# Altium schematic sheet STM32_microcontroller_IOs.SchDoc: STM32 microcontroller I/Os
size A4; Date: Not used; ApprovedBy: Not used; CheckedBy: Not used; Author: Not used; CompanyName: STMicroelectronics; DrawnBy: Not used; Engineer: Not used; Organization: Not used; Address1: Not used; Address2: Not used; Address3: Not used; Address4: Not used; DocumentNumber: 3; Revision: Not used; SheetNumber: 3; SheetTotal: 8; CurrentTime: Not used; CurrentDate: Not used; Time: Not used; DocumentFullPathAndName: Not used; DocumentName: Not used; ModifiedDate: Not used; ImagePath: Not used; ProjectName: Not used; Application_BuildNumber: Not used
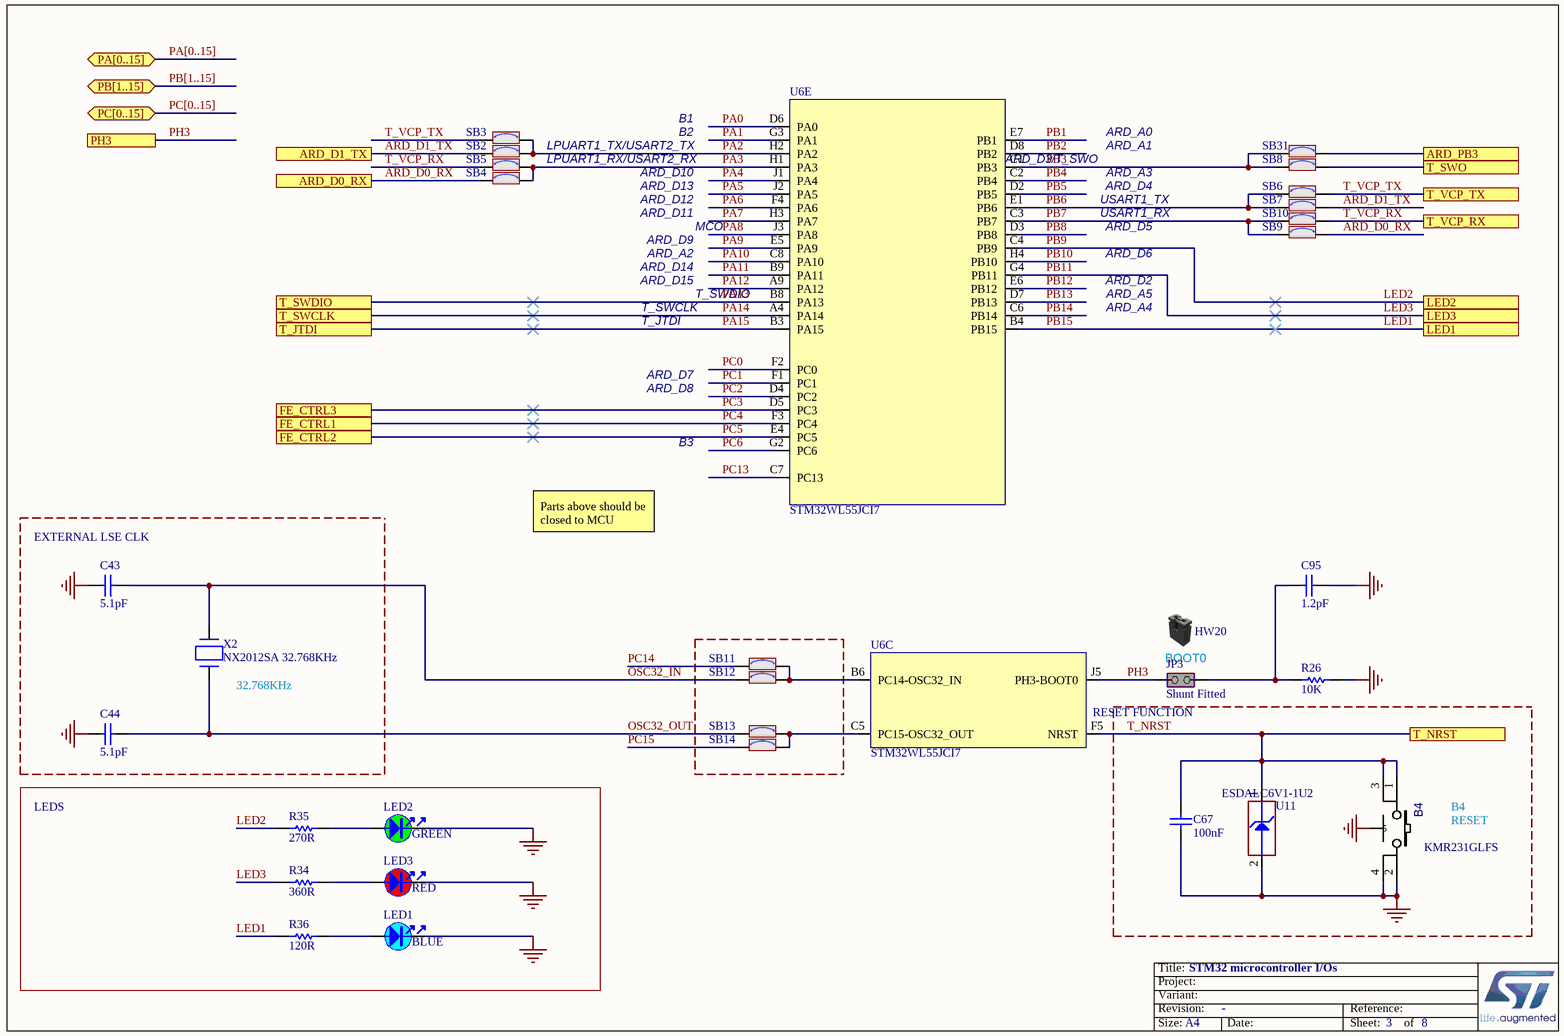
[diagram p0: STM32_microcontroller_IOs.SchDoc]

## Parts
B4  value KMR231GLFS  [SWI_C&K_Y78B23110FP__ITT_KMR231GLFS]
C43  value 5.1pF  [C0402]
C44  value 5.1pF  [C0402]
C67  value 100nF  [C0402]
C95  value 1.2pF  [C0402]  (hidden comment: Capacitor)
HW20  (no value)  (mechanical)
JP3  value Shunt Fitted  [CON_SAMTEC_TSW-102-07-G-S]
LED1  value BLUE  [LED_0603_OSRAM_LB-Q39G-L2OO-35-1_BLUE_1A2K_H0P4]
LED2  value GREEN  [LED_0603_OSRAM_LG-Q396-PS-35_GREEN_1A2K_H0P4]
LED3  value RED  [LED_0603_VISHAY_VLMS1300-GS08_RED_1A2K_H0P8]
R26  value 10K  [R0603]
R34  value 360R  [R0402]
R35  value 270R  [R0402]
R36  value 120R  [R0402]
SB2  (no value)  [SOLDER-BRIDGE_R0603-0R]
SB3  (no value)  [SOLDER-BRIDGE_R0603-0R]
SB4  (no value)  [SOLDER-BRIDGE_R0603-0R]
SB5  (no value)  [SOLDER-BRIDGE_R0603-0R]
SB6  (no value)  [SOLDER-BRIDGE_R0603-0R]
SB7  (no value)  [SOLDER-BRIDGE_R0603-0R]
SB8  (no value)  [SOLDER-BRIDGE_R0603-0R]
SB9  (no value)  [SOLDER-BRIDGE_R0603-0R]
SB10  (no value)  [SOLDER-BRIDGE_R0603-0R]
SB11  (no value)  [SOLDER-BRIDGE_R0603-0R]
SB12  (no value)  [SOLDER-BRIDGE_R0603-0R]
SB13  (no value)  [SOLDER-BRIDGE_R0603-0R]
SB14  (no value)  [SOLDER-BRIDGE_R0603-0R]
SB31  (no value)  [SOLDER-BRIDGE_R0603-0R]
U6  value STM32WL55JCI7  [ICC_UFBGA73_5X5_P050]  (parts C,E of 5)
U11  value ESDALC6V1-1U2  [ESD_ST0201]
X2  value NX2012SA 32.768KHz  [CRY_NX2012SA_2P]

## Blocks framed on the sheet
LEDS: LED1-LED3 R34-R36

## Ports
ARD_D0_RX, ARD_D1_TX, ARD_PB3, FE_CTRL1, FE_CTRL2, FE_CTRL3, LED1, LED2, LED3, PA[0..15] (bidir), PB[1..15] (bidir), PC[0..15] (bidir), PH3, T_JTDI, T_NRST, T_SWCLK, T_SWDIO, T_SWO, T_VCP_RX, T_VCP_TX

## Nets
GND: B4.2 B4.4 B4.5 C43.2 C44.2 C67.1 C95.1 LED1.2 LED2.2 LED3.2 R26.1 U11.2(GND)
ARD_D0_RX: SB4.2 SB9.1 ; port ARD_D0_RX
ARD_D1_TX: SB2.2 SB7.1 ; port ARD_D1_TX
ARD_PB3: SB31.2 ; port ARD_PB3
LED1: R36.1 U6.B4(PB15) ; port LED1  [also labelled PB15]
LED2: R35.1 U6.C4(PB9) ; port LED2  [also labelled PB9]
LED3: R34.1 U6.G4(PB11) ; port LED3  [also labelled PB11]
OSC32_IN: C43.1 SB12.1 X2.2(X2)
OSC32_OUT: C44.1 SB13.1 X2.1(X1)
PA0: U6.D6(PA0)
PA1: U6.G3(PA1)
PA2: SB2.1 SB3.2 U6.H2(PA2)
PA3: SB4.1 SB5.2 U6.H1(PA3)
PA4: U6.J1(PA4)
PA5: U6.J2(PA5)
PA6: U6.F4(PA6)
PA7: U6.H3(PA7)
PA8: U6.J3(PA8)
PA9: U6.E5(PA9)
PA10: U6.C8(PA10)
PA11: U6.B9(PA11)
PA12: U6.A9(PA12)
PA13: U6.B8(PA13) ; port T_SWDIO
PA14: U6.A4(PA14) ; port T_SWCLK
PA15: U6.B3(PA15) ; port T_JTDI
PB1: U6.E7(PB1)
PB2: U6.D8(PB2)
PB3: SB8.1 SB31.1 U6.C1(PB3)
PB4: U6.C2(PB4)
PB5: U6.D2(PB5)
PB6: SB6.1 SB7.2 U6.E1(PB6)
PB7: SB9.2 SB10.1 U6.C3(PB7)
PB8: U6.D3(PB8)
PB10: U6.H4(PB10)
PB12: U6.E6(PB12)
PB13: U6.D7(PB13)
PB14: U6.C6(PB14)
PC0: U6.F2(PC0)
PC1: U6.F1(PC1)
PC2: U6.D4(PC2)
PC3: U6.D5(PC3) ; port FE_CTRL3
PC4: U6.F3(PC4) ; port FE_CTRL1
PC5: U6.E4(PC5) ; port FE_CTRL2
PC6: U6.G2(PC6)
PC13: U6.C7(PC13)
PC14: SB11.1
PC15: SB14.1
PH3: JP3.1(COMMON) U6.J5(PH3-BOOT0) ; port PH3
T_NRST: B4.1 B4.3 C67.2 U6.F5(NRST) U11.1(IO1) ; port T_NRST
T_SWO: SB8.2 ; port T_SWO
T_VCP_RX: SB5.1 SB10.2 ; port T_VCP_RX
T_VCP_TX: SB3.1 SB6.2 ; port T_VCP_TX
NetC95_2: C95.2 JP3.2(NO) R26.2
NetLED1_1: LED1.1 R36.2
NetLED2_1: LED2.1 R35.2
NetLED3_1: LED3.1 R34.2
NetSB11_2: SB11.2 SB12.2 U6.B6(PC14-OSC32_IN)
NetSB13_2: SB13.2 SB14.2 U6.C5(PC15-OSC32_OUT)

## Buses and harness runs
bus PA[0..15] = port PA[0..15]
bus PB[1..15] = port PB[1..15]
bus PC[0..15] = port PC[0..15]

## Notes on the sheet
- LPUART1_TX/USART2_TX
- LPUART1_RX/USART2_RX
- ARD_D10
- B2
- B1
- ARD_D3/T_SWO
- ARD_A0
- ARD_A1
- ARD_A3
- ARD_D13
- ARD_D12
- ARD_D11
- ARD_D9
- MCO
- USART1_RX
- USART1_TX
- ARD_D5
- ARD_D4
- T_SWCLK
- T_SWDIO
- ARD_D14
- ARD_D15
- ARD_A2
- ARD_D6
- ARD_A4
- ARD_A5
- ARD_D2
- T_JTDI
- ARD_D7
- ARD_D8
- B3
- (near C43) EXTERNAL LSE CLK
- Parts above should be closed to MCU
- (near X2) 32.768KHz
- RESET FUNCTION
- (near JP3) BOOT0
- RESET
- B4
- Title:
- Project:
- Size:
- Revision:
- Variant:
- A4
- -
- Date:
- Reference:
- Sheet:
- of

## Library data of the parts
B4 = MCD-01485: Microminiature Tact Switch for SMT - KMR 2 Series - 1.9 mm height; Part_Type: Misc; Manufacturer: C&K; Provided_By: SUBCO; Internal_Part_Number: MCD-01485; Status: Checked; Manufacturer_Part_Number: KMR231GLFS; ComponentLink1Description: Datasheet; ComponentLink1URL: http://tunmcdsvn.tun.st.com/Component_Datasheet_Library/Trunk/Misc/C&K_tactile_switch_KMR_series; ECCN_US: n/a; ECCN_EU: n/a
C43 C44 = MCD-00003: Capacitor, MLCC, 5.1pF, 50V, NPO, +-0.25pF, 0402, T=0.5mm; Manufacturer_Part_Number: CC0402CRNPO9BN5R1; Manufacturer: YAGEO; Provided_By: SUBCO; ECCN_US: EAR99; ECCN_EU: NEC; Internal_Part_Number: MCD-00003; Status: Released; Part_Type: Capacitor; Package: C0402; ComponentLink1Description: Datasheet; ComponentLink1URL: http://tunmcdsvn.tun.st.com/Component_Datasheet_Library/Trunk/Capacitors/Yageo_Capacitor_NP0_16V-to-50V
C67 = MCD-00102: Capacitor, MLCC, 100nF, 16V, X7R, 10%, 0402, T=0,5mm; Manufacturer_Part_Number: CC0402KRX7R7BB104; Manufacturer: YAGEO; Alternate_Manufacturer_Part_Number: GCM155R71C104KA55D; Alternate_Manufacturer: MURATA; Provided_By: SUBCO; ECCN_US: EAR99; ECCN_EU: NEC; Internal_Part_Number: MCD-00102; Status: Released; Package: C0402; ComponentLink1Description: Datasheet; Part_Type: Capacitor; ComponentLink1URL: http://tunmcdsvn.tun.st.com/Component_Datasheet_Library/Trunk/Capacitors/Yageo_Multilayer_Capacitor_X7R_series_100pF_to_22uF
C95 = MCD-02065: Capacitor, High Q type for high frequency and high power, SMD, 1.2pF, 50V, 0,05pf, 0402; Part_Preference: Recommended; Manufacturer: MURATA; Manufacturer_Part_Number: GJM1555C1H1R2WB01D; Order_Code_RS: 846-7246; Internal_Part_Number: MCD-02065; BMS_Part_Number: N/A; Status: Checked; Part_Type: Capacitor; Alternate_Manufacturer: N/A; Alternate_Manufacturer_Part_Number: N/A; Package: C0402; ComponentLink1Description: Datasheet; ComponentLink1URL: http://tunmcdsvn.tun.st.com/Component_Datasheet_Library/Trunk/Capacitors/MURATA_Chip_Monolithic_Ceramic_Capacitors; Order_Code_Digikey: 490-11195-2-ND; Order_Code_Farnell: 2781428
HW20 = MCD-00043: SHUNT 2.54mm BLACK; Manufacturer_Part_Number: SNT-100-BK-G; Manufacturer: SAMTEC; Part_Type: Mechanical; Alternate_Manufacturer_Part_Number: 316102S111A; Alternate_Manufacturer: JIUBABA; Provided_By: SUBCO; Value: SNT-100-BK-G; Internal_Part_Number: MCD-00043; ComponentLink1Description: Datasheet; Status: Released; ComponentLink1URL: http://tunmcdsvn.tun.st.com/Component_Datasheet_Library/Trunk/Connectors/Samtec_Shunt_Jumper_SNT100; ECCN_US: n/a; ECCN_EU: n/a
JP3 = MCD-00683: Header, 2x1, 2,54mm, VR, TH, Height 5.84mm/2.54mm - Shunt Fitted by default; Part_Type: Connector; Manufacturer_Part_Number: TSW-102-07-x-S; Manufacturer: SAMTEC; Alternate_Manufacturer_Part_Number: 313102S111116; Alternate_Manufacturer: LIANYI; Provided_By: SUBCO; Internal_Part_Number: MCD-00683; Status: Released; ComponentLink1Description: Datasheet; ComponentLink1URL: http://tunmcdsvn.tun.st.com/Component_Datasheet_Library/Trunk/Connectors/Samtec_TSW-HTSW-series; ECCN_US: n/a; ECCN_EU: n/a
LED1 = MCD-00585: LED Blue, 0603 SMD, Forward Voltage Min=2,8V, Max=3,8V; Part_Type: Display; Manufacturer_Part_Number: LB Q39G-L2OO-35-1; Manufacturer: OSRAM OPTO SEMICONDUCTORS; Alternate_Manufacturer_Part_Number: 19-217-BHC-ZL1M2RY-3T-V4; Alternate_Manufacturer: EVERLIGHT; Order_Code_RS: 9148643; Provided_By: SUBCO; Internal_Part_Number: MCD-00585; Status: Released; Package: LED 0603; ComponentLink1Description: Datasheet; ComponentLink1URL: http://tunmcdsvn.tun.st.com/Component_Datasheet_Library/Trunk/Display/OSRAM_LED_BLUE_LB Q39G-L2OO-35-1; Order_Code_Digikey: 475-2816-1-ND; ECCN_US: n/a; ECCN_EU: n/a
LED2 = MCD-00588: LED Green, 0603 SMD, Forward Voltage Typ=2V, Max=2.5V; Part_Type: Display; Manufacturer_Part_Number: LG Q396-PS-35; Manufacturer: OSRAM OPTO SEMICONDUCTORS; Alternate_Manufacturer_Part_Number: VLMTG1300-GS08; Alternate_Manufacturer: VISHAY SEMICONDUCTOR OPTO DIVISION; Provided_By: SUBCO; Internal_Part_Number: MCD-00588; Status: Released; Package: LED 0603; ComponentLink1Description: Datasheet; ComponentLink1URL: http://tunmcdsvn.tun.st.com/Component_Datasheet_Library/Trunk/Display/OSRAM_LED_GREEN_LG Q396-PS-35; Order_Code_Digikey: LG Q396-PS-35-ND; ECCN_US: n/a; ECCN_EU: n/a
LED3 = MCD-00587: LED Red, 0603 SMD, 2V Forward Voltage; Part_Type: Display; Manufacturer_Part_Number: VLMS1300-GS08; Manufacturer: VISHAY; Alternate_Manufacturer_Part_Number: LS Q976-NR-1; Alternate_Manufacturer: OSRAM OPTO SEMICONDUCTORS; Provided_By: SUBCO; Internal_Part_Number: MCD-00587; Status: Released; Package: LED 0603; ComponentLink1Description: Datasheet; ComponentLink1URL: http://tunmcdsvn.tun.st.com/Component_Datasheet_Library/Trunk/Display/VISHAY_LED_RED_VLMS1300-GS08; Order_Code_Digikey: VLMS1300-GS08CT-ND; Order_Code_Farnell: 2078728; ECCN_US: n/a; ECCN_EU: n/a
R26 = MCD-00220: Resistor,10K,0603,1%,1/10W; Manufacturer_Part_Number: RC0603FR-0710KL; Manufacturer: YAGEO; Provided_By: SUBCO; ECCN_US: EAR99; ECCN_EU: NEC; Internal_Part_Number: MCD-00220; ComponentLink1Description: Datasheet; Status: Released; Part_Type: Resistor; Package: R0603; ComponentLink1URL: http://tunmcdsvn.tun.st.com/Component_Datasheet_Library/Trunk/Resistors/Yageo_Resistor_RC0603-series
R34 = MCD-00461: Resistor,360R,0402,1%,1/16W; Manufacturer_Part_Number: RC0402FR-07360RL; Manufacturer: YAGEO; Provided_By: SUBCO; ECCN_US: EAR99; ECCN_EU: NEC; Internal_Part_Number: MCD-00461; Status: Released; Part_Type: Resistor; Package: R0402; ComponentLink1Description: Datasheet; ComponentLink1URL: http://tunmcdsvn.tun.st.com/Component_Datasheet_Library/Trunk/Resistors/Yageo_Resistor_RC0402-series
R35 = MCD-00441: Resistor,270R,0402,1%,1/16W; Manufacturer_Part_Number: RC0402FR-07270RL; Manufacturer: YAGEO; Provided_By: SUBCO; ECCN_US: EAR99; ECCN_EU: NEC; Internal_Part_Number: MCD-00441; Status: Released; Part_Type: Resistor; Package: R0402; ComponentLink1Description: Datasheet; ComponentLink1URL: http://tunmcdsvn.tun.st.com/Component_Datasheet_Library/Trunk/Resistors/Yageo_Resistor_RC0402-series
R36 = MCD-00194: Resistor,120R,0402,1%,1/16W; Manufacturer_Part_Number: RC0402FR-07120RL; Manufacturer: YAGEO; Provided_By: SUBCO; ECCN_US: EAR99; ECCN_EU: NEC; Internal_Part_Number: MCD-00194; Status: Released; Part_Type: Resistor; Package: R0402; ComponentLink1Description: Datasheet; ComponentLink1URL: http://tunmcdsvn.tun.st.com/Component_Datasheet_Library/Trunk/Resistors/Yageo_Resistor_RC0402-series
SB2-SB14 SB31 = MCD-00071: Solder Bridge ON; Part_Type: Mechanical; Manufacturer_Part_Number: RC0603JR-070RL; Manufacturer: YAGEO; Provided_By: SUBCO; Internal_Part_Number: MCD-00071; Status: Released; Package: SB0603; ComponentLink1Description: Datasheet; ComponentLink1URL: http://tunmcdsvn.tun.st.com/Component_Datasheet_Library/Trunk/Resistors/Yageo_Resistor_RC0603-series; ECCN_US: n/a; ECCN_EU: n/a
U6 = MCD-01435: Multiprotocol Wireless 32-bit MCUwith LPWAN Sub-GHz radio solution; Part_Type: IC; Manufacturer: STMICROELECTRONICS; ECCN_US: tbd; Internal_Part_Number: MCD-01435; Status: Footprint available; Manufacturer_Part_Number: STM32WL55JCI7; Package: UFBGA73; ComponentLink1Description: Datasheet; ComponentLink1URL: http://tunmcdsvn.tun.st.com/Component_Datasheet_Library/Trunk/IC/STM_STM32WL5x; Provided_By: n/a; ECCN_EU: tbd
U11 = MCD-00170: ESD protection 6V1; Part_Type: Diode; Manufacturer: STMICROELECTRONICS; BMS_Part_Number: 9151132; Provided_By: SUBCO with ST control; ECCN_US: EAR99; ECCN_EU: NEC; Internal_Part_Number: MCD-00170; Status: Released; Manufacturer_Part_Number: ESDALC6V1-1U2; ComponentLink1Description: Datasheet; ComponentLink1URL: http://tunmcdsvn.tun.st.com/Component_Datasheet_Library/Trunk/Diodes/STM_ESD_ESDALC6V1-1U2
X2 = MCD-01479: Crystal 32.768kHz, 6pF, -+20ppm, 80Kohm max, SMD; Part_Type: Crystal_Osc; Manufacturer_Part_Number: NX2012SA 32.768KHz EXS00A-MU00527; Manufacturer: NDK; BMS_Part_Number: 9157049; Provided_By: SUBCO; ECCN_US: EAR99; ECCN_EU: NEC; Internal_Part_Number: MCD-01479; Status: Checked; Package: NX2012SA; ComponentLink1Description: Datasheet; ComponentLink1URL: http://tunmcdsvn.tun.st.com/Component_Datasheet_Library/Trunk/Crystal_Osc/NDK_NX2012SA 32.768KHz EXS00A-MU00527; Order_Code_Digikey: 644-1352